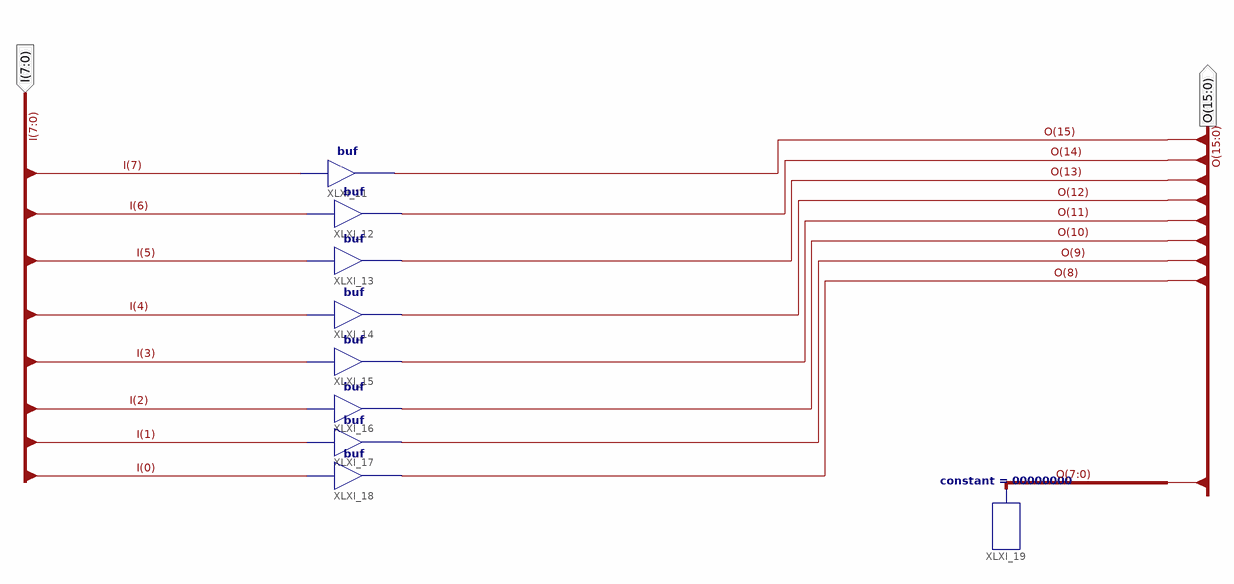
[diagram p0: schematic sheet 1]
// Xilinx ISE schematic leftshift0.sch (spartan3e) as structural Verilog: 9 symbols, 2 ports
module leftshift0 (
  input  [7:0] I,
  output [15:0] O
);

  buf XLXI_11 (O[15], I[7]);
  buf XLXI_12 (O[14], I[6]);
  buf XLXI_13 (O[13], I[5]);
  buf XLXI_14 (O[12], I[4]);
  buf XLXI_15 (O[11], I[3]);
  buf XLXI_16 (O[10], I[2]);
  buf XLXI_17 (O[9], I[1]);
  buf XLXI_18 (O[8], I[0]);
  constant #(.CValue("00000000")) XLXI_19 (.O(O[7:0]));
endmodule
